# EAGLE design Adafruit VEML6070 (EAGLE 6.4)
AUTHOR: KTOWN
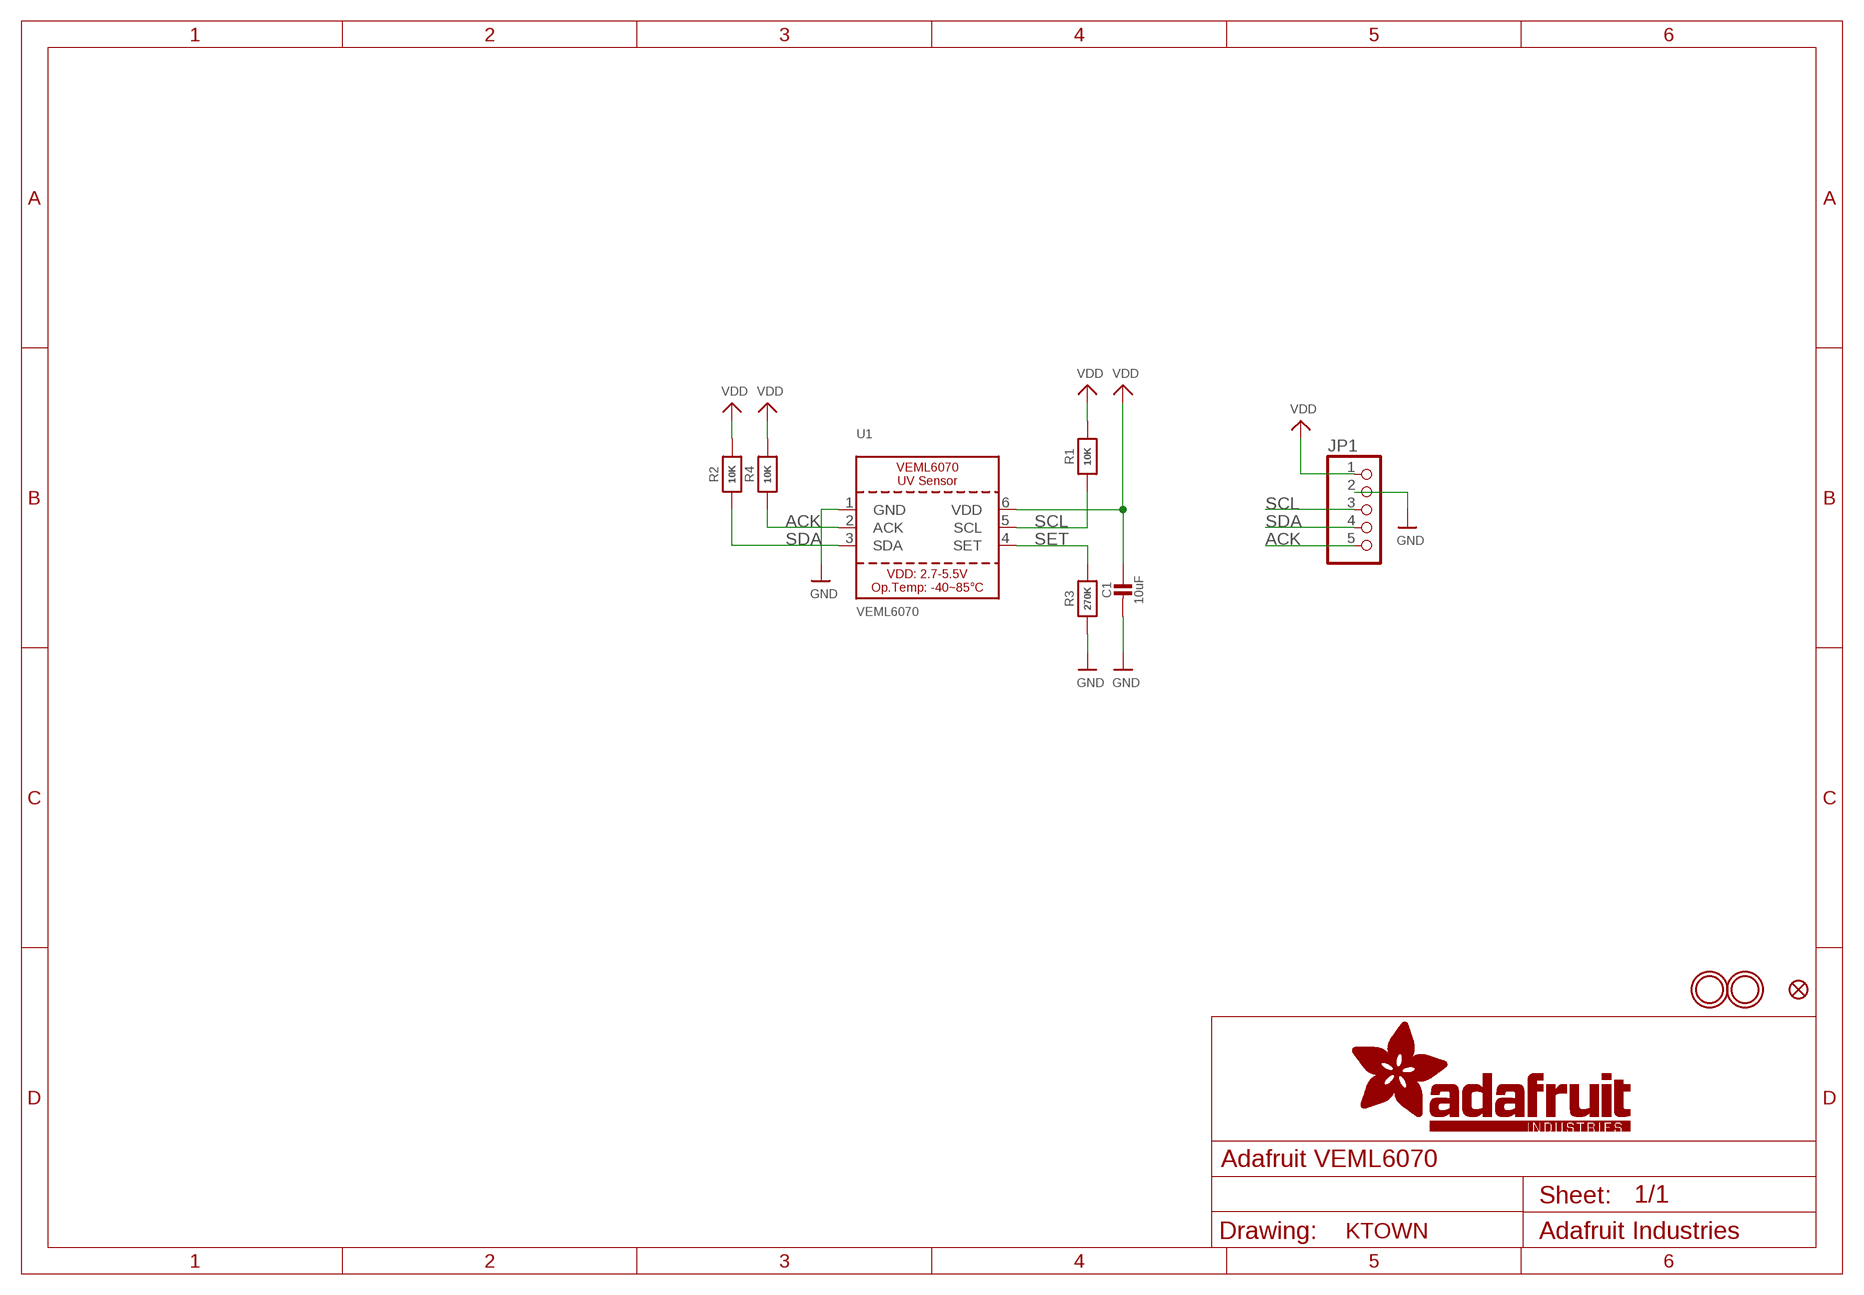
[diagram p0: schematic, sheet 1]

## Parts
C1  10uF  CAP_CERAMIC0805-NOOUTLINE  [0805-NO]
FID1  FIDUCIAL""  [FIDUCIAL_1MM]
JP1  HEADER-1X570MIL  [1X05_ROUND_70]
R1  10K  RESISTOR0805_NOOUTLINE  [0805-NO]
R2  10K  RESISTOR0805_NOOUTLINE  [0805-NO]
R3  270K  RESISTOR0805_NOOUTLINE  [0805-NO]
R4  10K  RESISTOR0805_NOOUTLINE  [0805-NO]
U1  VEML6070  UV_VEML6070  [VEML6070]
U$10  MOUNTINGHOLE2.5  [MOUNTINGHOLE_2.5_PLATED]
U$11  MOUNTINGHOLE2.5  [MOUNTINGHOLE_2.5_PLATED]

## Nets
ACK: JP1.5 R4.1 U1.2(ACK)
GND: C1.2 JP1.2 R3.1 U1.1(GND)
SCL: JP1.3 R1.1 U1.5(SCL)
SDA: JP1.4 R2.1 U1.3(SDA)
SET: R3.2 U1.4(SET)
VDD: C1.1 JP1.1 R1.2 R2.2 R4.2 U1.6(VDD)

## Library data of the parts
C1 = microbuilder:CAP_CERAMIC: Ceramic Capacitors For new designs, use the packages preceded by an '_' character since they are more reliable: The following footprints should be used on most boards: _0402 - Standard footprint for regular board layouts _0603 - Standard footprint for regular board layouts _0805 - Standard footprint for regular board layouts _1206 - Standard footprint for regular board layouts For extremely tight-pitch boards where space is at a premium, the following 'micro-pitch' footprints can be used (smaller pads, no silkscreen outline, etc.): _0402MP - Micro-pitch footprint for very dense/compact boards _0603MP - Micro-pitch footprint for very dense/compact boards _0805MP - Micro-pitch footprint for very dense/compact boards _1206MP - Micro-pitch footprint for very dense/compact boards
FID1 = microbuilder:FIDUCIAL: Fiducial Alignment Points Various fiducial points for machine vision alignment.; BOM: EXCLUDE
JP1 = microbuilder:HEADER-1X5: PIN HEADER
R1-R4 = microbuilder:RESISTOR: Resistors For new designs, use the packages preceded by an '_' character since they are more reliable: The following footprints should be used on most boards: _0402 - Standard footprint for regular board layouts _0603 - Standard footprint for regular board layouts _0805 - Standard footprint for regular board layouts _1206 - Standard footprint for regular board layouts For extremely tight-pitch boards where space is at a premium, the following 'micro-pitch' footprints can be used (smaller pads, no silkscreen outline, etc.): _0402MP - Micro-pitch footprint for very dense/compact boards _0603MP - Micro-pitch footprint for very dense/compact boards _0805MP - Micro-pitch footprint for very dense/compact boards _1206MP - Micro-pitch footprint for very dense/compact boards
U1 = microbuilder:UV_VEML6070: VEML6070 - UV Light Sensor Supply: 2.7-5.5V Peak Sensitivity: 355nm Spectral Range: 320-410nm
U$10 U$11 = microbuilder:MOUNTINGHOLE: Mounting Hole For #2 screws (0.086"/2.18mm width, 0.094"/2.4mm hole) use 2.5mm; BOM: EXCLUDE

## Board
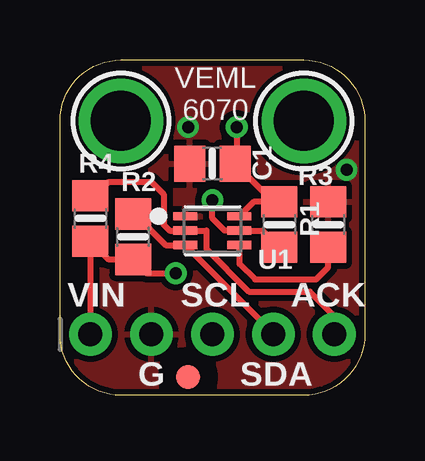
[diagram p1: board, top side]
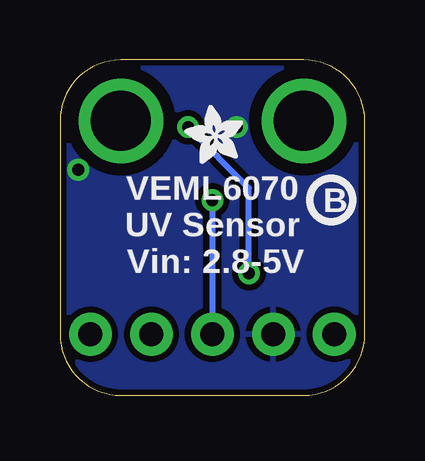
[diagram p2: board, bottom side, seen from below]

Size 12.7 x 13.97 mm. Coordinates in mm from the lower left corner, seen from the top.
Outline: 12.7,11.43 12.7,2.54 arc-90 10.16,0 2.54,0 arc-90 0,2.54 0,11.43 arc-90 2.54,13.97 10.16,13.97 arc-90 12.7,11.43
Copper layers (1*16): Top 0.035mm / dielectric 1.5mm / Bottom 0.035mm
Design rules "adafruit": minimum track width 8mil, minimum drill 15.5mil, track to track 8mil, track to pad 8mil, pad to pad 8mil, via to via 8mil, smd to smd 8mil, copper to edge 10mil, drill to drill 8mil, minimum pad ring 10mil, minimum via ring 8mil, stop-mask expansion 2mil, vias tented up to drill 20mil, thermal gap 10mil

### Footprints (pad centres in the part's own frame; a part is rotated, then mirrored left to right if it is on the bottom)
0805-NO = smd 1.3 x 1.5: 1 -0.95,0; 2 0.95,0
FIDUCIAL_1MM = smd 1 x 1: 1 0,0
1X05_ROUND_70 = drill 1 pad 1.778: 1 -5.08,0; 2 -2.54,0; 3 0,0; 4 2.54,0; 5 5.08,0
VEML6070 = smd 1 x 0.35: 1 -1.125,0.6; 2 -1.125,0; 3 -1.125,-0.6; 4 1.125,-0.6; 5 1.125,0; 6 1.125,0.6
MOUNTINGHOLE_2.5_PLATED = drill 2.5 pad 3.2: P$1 0,0

### Placement (x,y rotation side)
C1  6.35,9.65 180 top
FID1  5.33,0.76 0 top
JP1  6.35,2.54 0 top
R1  9.14,7.11 90 top
R2  3.05,6.6 270 top
R3  11.18,7.11 270 top
R4  1.27,7.37 270 top
U1  6.35,6.86 0 top
U$2  [PCBFEAT-REV-040]  1.4,8.13 0 bottom
U$10  2.54,11.43 0 top
U$11  10.16,11.43 0 top
U$14  [ADAFRUIT_2.5MM]  5.08,9.65 90 bottom

### Tracks (layer width: path | path; a pad name or v marks a point on that pad's centre or on a via)
ACK
  Top 0.254: R4.1 1.46,8.32 2.03,8.89 3.81,8.89 4.32,8.38 4.32,7.11 4.57,6.86 U1.2 6.1,6.86 6.1,6.1 7.87,4.32 10.41,4.32 11.43,3.3 JP1.5
GND  (via drill 0.5)
  other vias: 5.33,11.18 11.94,9.4
  pour Top (isolate 0.254): 0,0 0,13.97 12.7,13.97 12.7,0
  pour Bottom (isolate 0.254): 0,0 0,13.97 12.7,13.97 12.7,0
SCL  (via drill 0.5)
  Top 0.254: R1.1 8.45,6.86 U1.5 6.86,6.86 6.35,7.37 v6.35,8.13
  Bottom 0.254: v6.35,8.13 JP1.3
SDA
  Top 0.254: R2.1 3.11,7.55 4.41,6.26 U1.3 8.89,2.59 JP1.4
SET
  Top 0.254: U1.4 7.47,5.48 8.13,4.83 10.67,4.83 11.18,5.33 R3.2
VDD  (via drill 0.5)
  Top 0.254: JP1.1 R4.2 2.03,5.65 R2.2 3.62,5.08 v4.83,5.08 | U1.6 8.08,8.06 R1.2 8.89,8.06 C1.1 7.37,9.46 v7.37,11.18
  Bottom 0.254: v4.83,5.08 4.83,8.64 v7.37,11.18

### Text on the board
tPlace: VEML / 6070 | VIN | SCL | ACK | G | SDA
bPlace: VEML6070 / UV Sensor | Vin: 2.8-5V